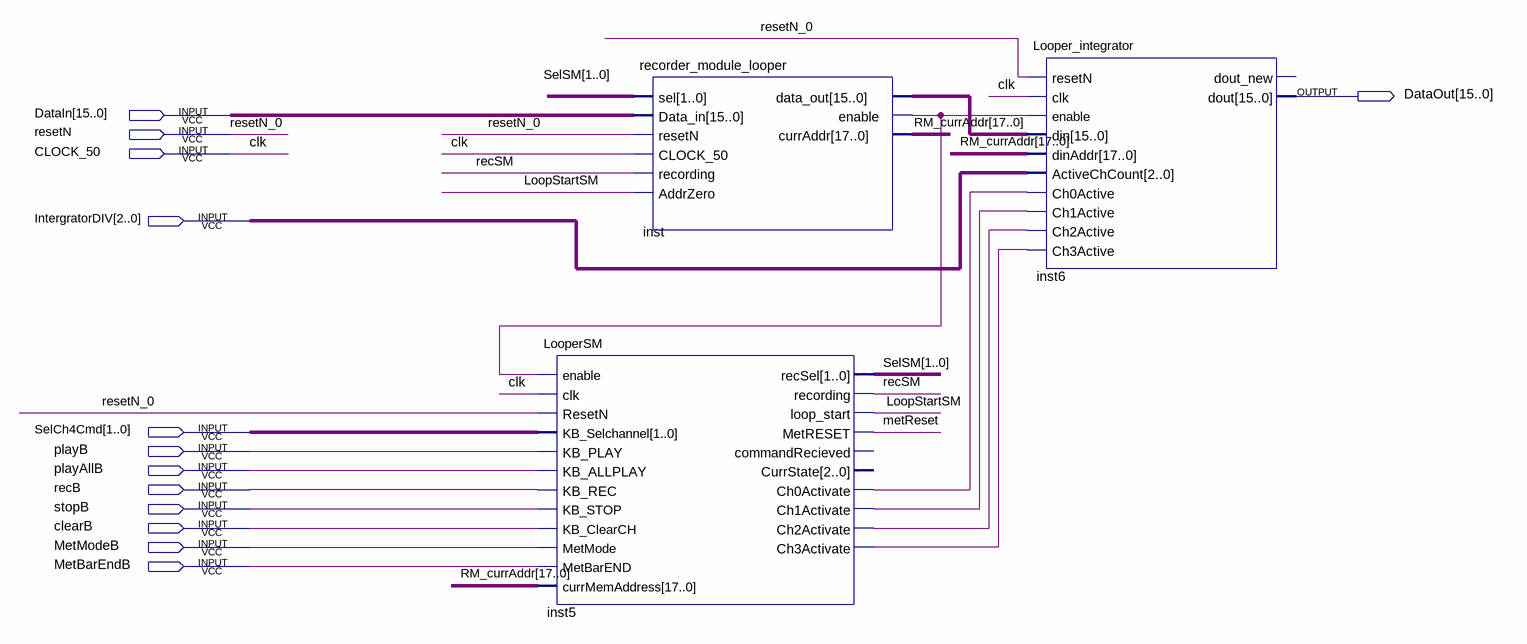
[diagram p0: schematic sheet]
// Quartus schematic LooperMemController.bdf as structural Verilog: 3 symbols, 13 pins
module LooperMemController (
  input  [15:0] DataIn,
  input  resetN,
  input  CLOCK_50,
  input  [2:0] IntergratorDIV,
  input  [1:0] SelCh4Cmd,
  input  playB,
  input  playAllB,
  input  recB,
  input  stopB,
  input  clearB,
  input  MetModeB,
  input  MetBarEndB,
  output [15:0] DataOut
);

  wire inst5_ch0activate, inst5_ch1activate, inst5_ch2activate, inst5_ch3activate, inst_enable, LoopStartSM,
       metReset, recSM;
  wire [1:0] SelSM;
  wire [15:0] inst_data_out;
  wire [17:0] RM_currAddr;

  LooperSM inst5 (
    .enable(inst_enable), .clk(CLOCK_50), .ResetN(resetN), .KB_Selchannel(SelCh4Cmd), .KB_PLAY(playB),
    .KB_ALLPLAY(playAllB), .KB_REC(recB), .KB_STOP(stopB), .KB_ClearCH(clearB), .MetMode(MetModeB),
    .MetBarEND(MetBarEndB), .currMemAddress(RM_currAddr), .recSel(SelSM), .recording(recSM),
    .loop_start(LoopStartSM), .MetRESET(metReset), .Ch0Activate(inst5_ch0activate),
    .Ch1Activate(inst5_ch1activate), .Ch2Activate(inst5_ch2activate), .Ch3Activate(inst5_ch3activate));  // open: commandRecieved, CurrState
  recorder_module_looper inst (
    .sel(SelSM), .Data_in(DataIn), .resetN(resetN), .CLOCK_50(CLOCK_50), .recording(recSM),
    .AddrZero(LoopStartSM), .data_out(inst_data_out), .enable(inst_enable), .currAddr(RM_currAddr));
  Looper_integrator inst6 (
    .resetN(resetN), .clk(CLOCK_50), .enable(inst_enable), .din(inst_data_out), .dinAddr(RM_currAddr),
    .ActiveChCount(IntergratorDIV), .Ch0Active(inst5_ch0activate), .Ch1Active(inst5_ch1activate),
    .Ch2Active(inst5_ch2activate), .Ch3Active(inst5_ch3activate), .dout(DataOut));  // open: dout_new

  // Other names for the same wires on the sheet: clk = CLOCK_50; resetN_0 = resetN
endmodule
